# EAGLE design MRF49XA--0805 Mod (EAGLE 6.2)
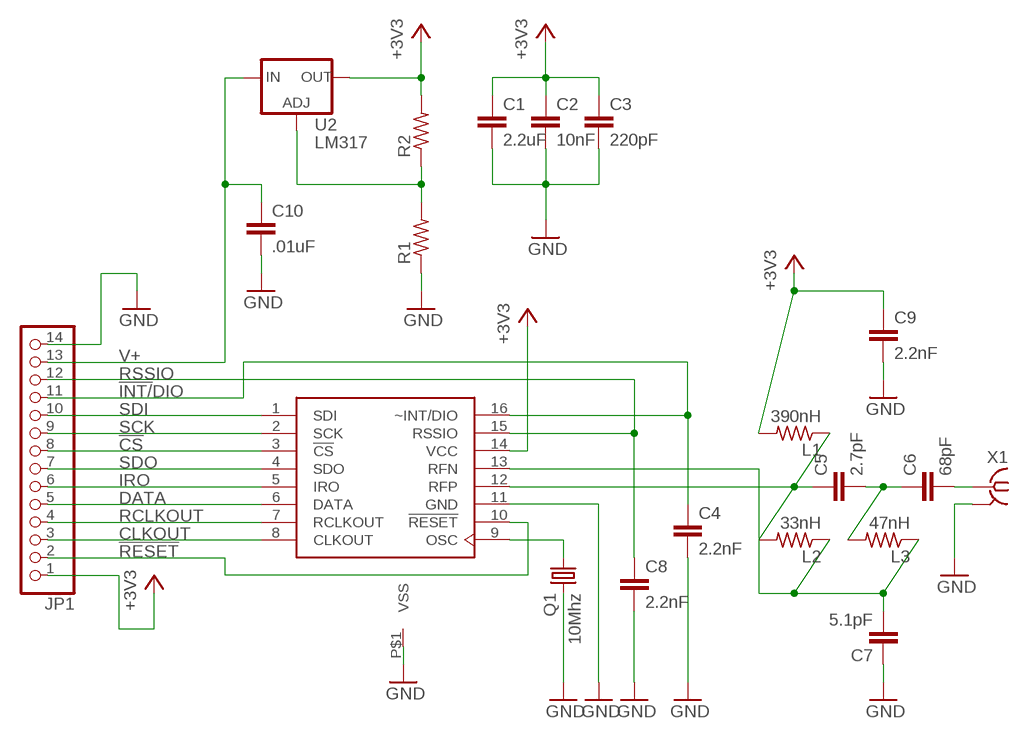
[diagram p0: schematic, sheet 1]

## Parts
C1  2.2uF  C-EUC0805  [C0805]
C2  10nF  C-EUC0805  [C0805]
C3  220pF  C-EUC0805  [C0805]
C4  2.2nF  C-EUC0805  [C0805]
C5  2.7pF  C-EUC0805  [C0805]
C6  68pF  C-EUC0805  [C0805]
C7  5.1pF  C-EUC0805  [C0805]
C8  2.2nF  C-EUC0805  [C0805]
C9  2.2nF  C-EUC0805  [C0805]
C10  .01uF  C-EUC0805  [C0805]
JP1  PINHD-1X14  [1X14]
L1  390nH  R-US_R0805  [R0805]
L2  33nH  R-US_R0805  [R0805]
L3  47nH  R-US_R0805  [R0805]
Q1  10Mhz  CRYSTALCTS406  [CTS406]
R1  R-US_M0805  [M0805]
R2  R-US_M0805  [M0805]
U2  LM317  V_REG_317SMD  [SOT223]
U$1  MRF49XA  [TSSOP16]
X1  SMA-142-0701-871/876  [J502-ND-142-0701-871/876]

## Nets
!CS: JP1.8 U$1.3(!CS)
!INT/!DIO: C4.1 JP1.11 U$1.16(~INT/DIO)
!RESET: JP1.2 U$1.10(!RESET)
+3V3: C1.1 C2.1 C3.1 C9.1 JP1.1 L1.2 R2.2 U2.2(OUT) U$1.14(VCC)
CLKOUT: JP1.3 U$1.8(CLKOUT)
DATA: JP1.5 U$1.6(DATA)
GND: C1.2 C2.2 C3.2 C4.2 C7.1 C8.2 C9.2 C10.2 JP1.14 Q1.3 R1.1 U$1.11(GND) U$1.P$1(VSS) X1.G@1(GND)
IRO: JP1.6 U$1.5(IRO)
N$1: Q1.1 U$1.9(OSC)
N$2: C5.2 C6.1 L3.2
N$4: C6.2 X1.1
N$15: C7.2 L2.1 L3.1 U$1.13(RFN)
N$16: C5.1 L1.1 L2.2 U$1.12(RFP)
N$19: R1.2 R2.1 U2.1(ADJ)
RCLKOUT: JP1.4 U$1.7(RCLKOUT)
RSSIO: C8.1 JP1.12 U$1.15(RSSIO)
SCK: JP1.9 U$1.2(SCK)
SDI: JP1.10 U$1.1(SDI)
SDO: JP1.7 U$1.4(SDO)
V+: C10.1 JP1.13 U2.3(IN)

## Power pins joined to a net without a drawn wire
GND: X1.G@2(GND) X1.G@3(GND) X1.G@4(GND)

## Library data of the parts
C1-C10 = rcl:C-EU: CAPACITOR, European symbol
JP1 = pinhead:PINHD-1X14: PIN HEADER
L1-L3 = resistor:R-US_: RESISTOR, American symbol
Q1 = crystal:CRYSTAL: CRYSTAL
R1 R2 = rcl:R-US_: RESISTOR, American symbol
U2 = SparkFun:V_REG_317: Voltage Regulator Standard LM317 adjustable voltage regulator. AOI (Adjust Output Input). Google 'LM317 Calculator' for easy to use app to get the two resistor values needed. 240/720 for 5V output. 240/390 for 3.3V output. Spark Fun Electronics SKU : COM-00527
U$1 = microchip:MRF49XA
X1 = con-coax:SMA-: SMA 50 Ohm End Launch Jack Receptacle - Round Contact Johnson Components Source: www.johnsoncomponents.com .. J502-ND.pdf

## Board
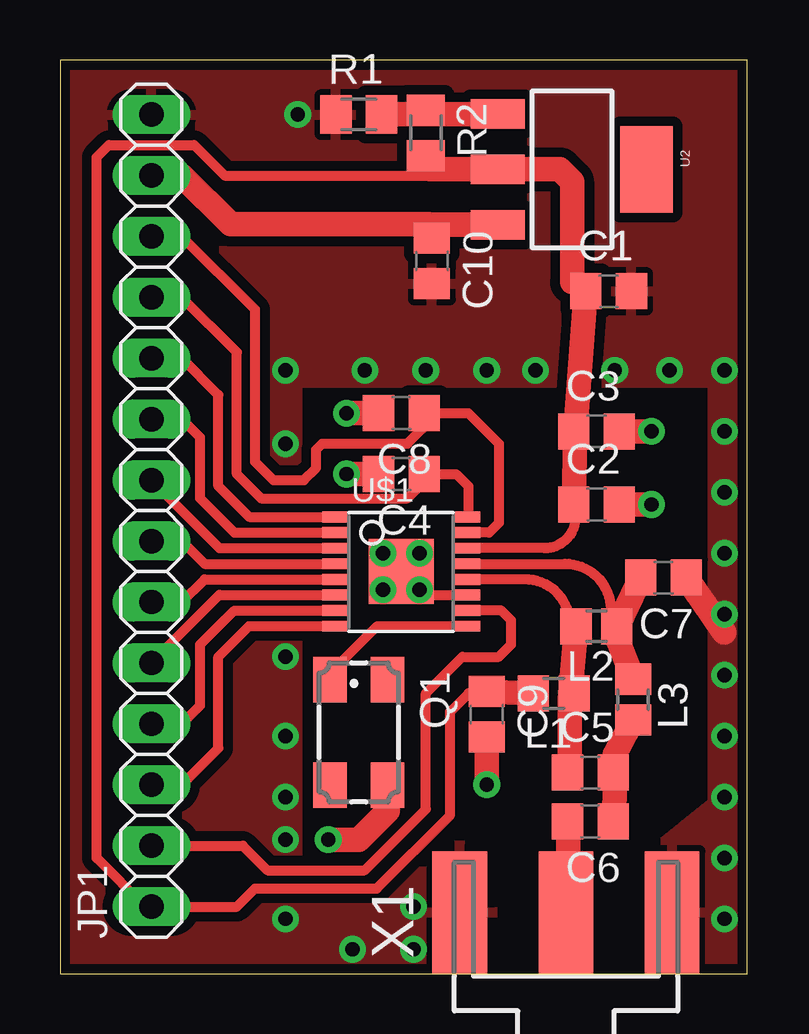
[diagram p1: board, top side]
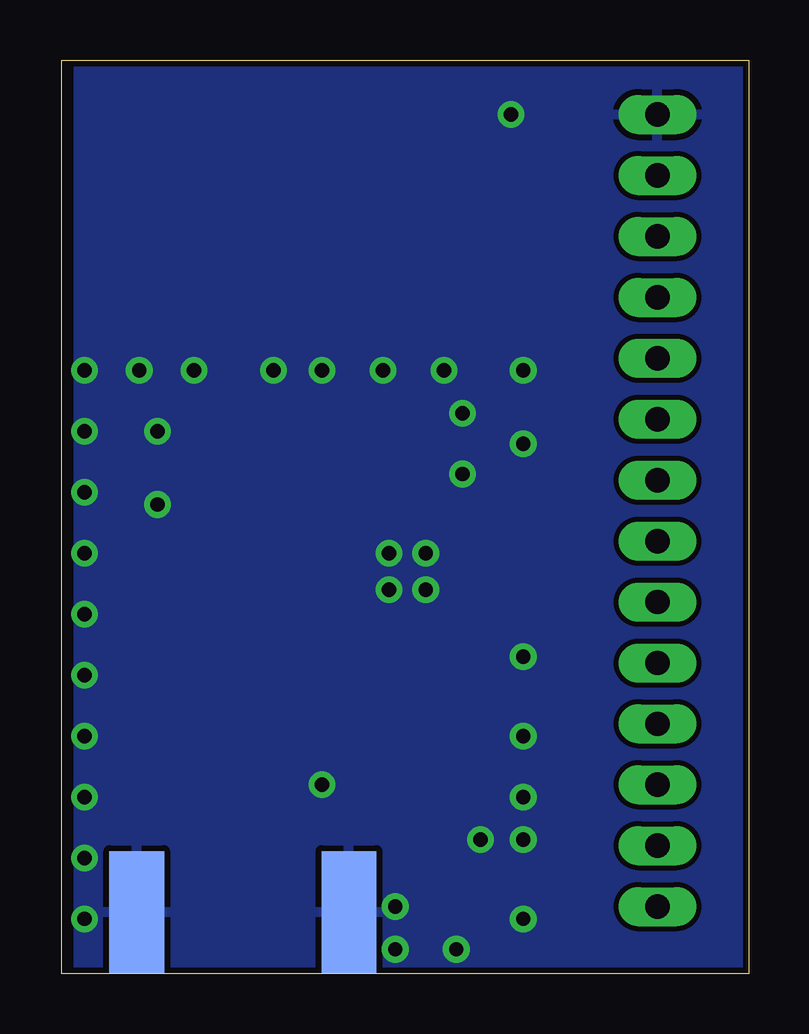
[diagram p2: board, bottom side, seen from below]

Size 28.63 x 38.09 mm. Coordinates in mm from the lower left corner, seen from the top.
Outline: 0,0 28.63,0 28.63,38.09 0,38.09 0,0
Copper layers (1*16): Top 0.035mm / dielectric 1.5mm / Bottom 0.035mm
Design rules: minimum track width 8mil, minimum drill 20mil, track to track 8mil, track to pad 8mil, pad to pad 8mil, via to via 8mil, smd to smd 8mil, copper to edge 10mil, drill to drill 8mil, minimum pad ring 12mil, minimum via ring 10mil, stop-mask expansion 4mil, vias tented up to drill 25mil, thermal gap 10mil

### Footprints (pad centres in the part's own frame; a part is rotated, then mirrored left to right if it is on the bottom)
C0805 = smd 1.3 x 1.5: 1 -0.95,0; 2 0.95,0
1X14 = drill 1.016 long: 1 -16.51,0; 2 -13.97,0; 3 -11.43,0; 4 -8.89,0; 5 -6.35,0; 6 -3.81,0; 7 -1.27,0; 8 1.27,0; 9 3.81,0; 10 6.35,0; 11 8.89,0; 12 11.43,0; 13 13.97,0; 14 16.51,0
R0805 = smd 1.3 x 1.5: 1 -0.85,0; 2 0.85,0
CTS406 = smd 1.9 x 1.4: 1 -2.2,-1.2; 2 2.2,-1.2; 3 2.2,1.2; 4 -2.2,1.2
M0805 = smd 1.3 x 1.6: 1 -0.95,0; 2 0.95,0
SOT223 = smd 1.219 x 2.235: 1 -2.311,-3.099; 2 0,-3.099; 3 2.311,-3.099 | smd 3.6 x 2.2: 4 0,3.099
TSSOP16 = smd 0.45 x 1.05: 1 -2.275,-2.768; 2 -1.625,-2.768; 3 -0.975,-2.768; 4 -0.325,-2.768; 5 0.325,-2.768; 6 0.975,-2.768; 7 1.625,-2.768; 8 2.275,-2.768; 9 2.275,2.768; 10 1.625,2.768; 11 0.975,2.768; 12 0.325,2.768; 13 -0.325,2.768; 14 -0.975,2.768; 15 -1.625,2.768; 16 -2.275,2.768 | smd 2.7 x 2.7: P$1 0,0
J502-ND-142-0701-871/876 = smd 5.08 x 2.286: 1 2.565,0; G@1 2.565,4.42; G@2 2.565,-4.42 | smd 5.08 x 2.286 bottom: G@3 2.565,4.42; G@4 2.565,-4.42

### Placement (x,y rotation side)
C1  22.86,28.45 0 top
C2  22.35,19.56 0 top
C3  22.35,22.61 0 top
C4  14.22,20.83 180 top
C5  22.1,8.38 0 top
C6  22.1,6.35 180 top
C7  25.15,16.51 180 top
C8  14.22,23.37 180 top
C9  17.78,10.82 270 top
C10  15.49,29.72 270 top
JP1  3.81,19.3 90 top
L1  20.57,11.68 180 top
L2  22.35,14.48 180 top
L3  23.88,11.43 270 top
Q1  12.45,10.05 270 top
R1  12.45,35.81 0 top
R2  15.24,35.05 270 top
U2  21.34,33.53 270 top
U$1  14.22,16.76 270 top
X1  21.08,0 90 top

### Tracks (layer width: path | path; a pad name or v marks a point on that pad's centre or on a via)
!CS
  Top 0.406: JP1.8 6.64,17.74 U$1.3
!INT/!DIO
  Top 0.406: 17.02,19.05 16.75,19.05 | U$1.16 17.01,19.04 17.02,19.05 | 17.02,19.05 17.02,20.32 16.51,20.83 C4.1 15.1,20.43 14.48,19.81 8.38,19.81 7.37,20.83 7.37,25.91 5.08,28.19 JP1.11
!RESET
  Top 0.406: U$1.10 18.39,15.14 18.8,14.73 18.8,13.72 18.29,13.21 16.76,13.21 15.24,11.68 15.24,6.86 12.7,4.32 8.64,4.32 7.62,5.33 JP1.2
+3V3
  Top 0.406: C9.1 17.03,11.69 16.26,10.92 16.26,6.6 13.21,3.56 8.13,3.56 7.37,2.79 JP1.1 3.56,2.79 1.52,4.83 1.52,34.04 2.03,34.54 5.59,34.54 6.86,33.27 15.41,33.27 15.41,33.53 | U$1.14 20.2,17.74 arc90 21.48,19.02 C2.1 | 21.34,28.83 21.46,28.83 C1.1
  Top 1.016: 21.34,28.83 21.34,33.02 20.83,33.53 U2.2 15.41,33.53 R2.2 | L1.2 19.47,11.69 C9.1 | C1.1 21.46,22.61 C3.1 21.48,22.61 C2.1
CLKOUT
  Top 0.406: JP1.3 5.08,7.87 6.6,9.4 6.6,13.21 7.88,14.49 U$1.8
DATA
  Top 0.406: JP1.5 6.64,15.79 U$1.6
GND  (via drill 0.6)
  Top 0.406: U$1.P$1 v13.46,16 | U$1.11 15.2,15.79 v14.99,16
  Top 1.016: C2.2 v24.64,19.56 | C3.2 v24.64,22.61 | v11.18,5.59 12.45,5.59 13.65,6.79 Q1.3 | v11.94,23.37 C8.2 | v11.94,20.83 C4.2 | C7.1 27.69,14.22 | C9.2 v17.78,7.87
  other vias: 17.78,25.15 9.91,35.81 15.24,25.15 12.7,25.15 9.4,25.15 9.4,22.1 19.81,25.15 23.11,25.15 25.4,25.15 27.69,25.15 27.69,22.61 27.69,20.07 27.69,17.53 27.69,14.99 27.69,12.45 27.69,9.91 27.69,7.37 27.69,4.83 27.69,2.29 14.73,1.02 12.19,1.02 9.4,2.29 9.4,5.59 9.4,7.37 9.4,9.91 9.4,13.21 14.73,2.79 13.46,17.53 14.99,17.53
  pour Bottom: 0,38.35 27.94,38.35 27.94,0.25 0,0.25
  pour Top (isolate 0.406): -0.25,38.35 -0.25,0 18.03,0 18.03,5.33 15.75,5.33 13.21,2.79 9.91,2.79 9.91,24.64 27.18,24.64 27.18,7.11 24.64,5.08 24.64,0.25 28.45,0.25 28.45,38.35
IRO
  Top 0.406: JP1.6 5.08,15.49 6.03,16.44 U$1.5
N$1
  Top 0.406: U$1.9 13.22,14.49 11.25,12.52 Q1.1
N$2
  Top 1.016: 23.11,9.14 23.11,7.37 C6.1 | 23.11,9.14 L3.2 | 23.11,9.14 C5.2
N$4
  Top 0.406: 21.22,2.93 21.08,2.93 X1.1
  Top 1.016: 21.22,2.93 C6.2
N$15
  Top 0.406: L2.1 22.95,15.18 arc90 21.04,17.09 U$1.13
  Top 1.016: 23.11,14.22 L3.1 | 23.11,14.22 C7.2 | L2.1 23.11,14.22
N$16
  Top 0.406: L2.2 21.25,14.57 arc90 19.38,16.44 U$1.12
  Top 1.016: 21.25,11.43 21.25,9.14 C5.1 | 21.25,11.43 L2.2 | 21.25,11.43 L1.1
N$19
  Top 0.406: R1.2 13.32,35.84 | 15.24,35.84 R2.1
  Top 1.016: 13.32,35.84 15.24,35.84 U2.1
RCLKOUT
  Top 0.406: JP1.4 5.08,10.41 5.84,11.18 5.84,13.72 7.26,15.14 U$1.7
RSSIO
  Top 0.406: U$1.15 17.88,18.39 18.29,18.8 18.29,22.1 17.02,23.37 C8.1 15.1,22.72 14.48,22.1 10.92,22.1 10.67,21.84 10.67,21.08 10.16,20.57 8.89,20.57 8.13,21.34 8.13,27.69 5.08,30.73 JP1.12
SCK
  Top 0.406: JP1.9 5.08,23.11 5.84,22.35 5.84,19.81 7.26,18.39 U$1.2
SDI
  Top 0.406: JP1.10 5.08,25.65 6.6,24.13 6.6,20.32 7.88,19.04 U$1.1
SDO
  Top 0.406: JP1.7 5.08,18.03 6.03,17.09 U$1.4
V+
  Top 1.016: JP1.13 5.08,33.27 7.11,31.24 15.37,31.24 C10.1 15.59,31.22 U2.3

### Text on the board
_tsilk: LM317 | GND | R1 | VCC | R2 | RSSIO | .01uF | !INT!/DIO | Fence | 2.2uF | SDI | 2.2nF | SCK | 220pF | !CS | 2.2nF | 10nF | SDO | IRO | 33nH | 5.1pF | MRF49XA | 47nH | DATA | 2.2nF | 390nH | RCO | 2.7pF | CLKO | 68pF | 10Mhz | !RST | 3.3v | JP1
_bsilk: GND | V+ | RSSIO | !INT/!DIO | SDI | SCK | !CS | SDO | IRO | DATA | RCLKOUT | CLKOUT | !RESET | TAPR Open Hardware License | Licensed under the | (C) 2010 - William Dillon KD7VMY | Philomath Oregon | Custom Radio Devices | MRF49XA Breakout Board Rev. 1 | 3.3v